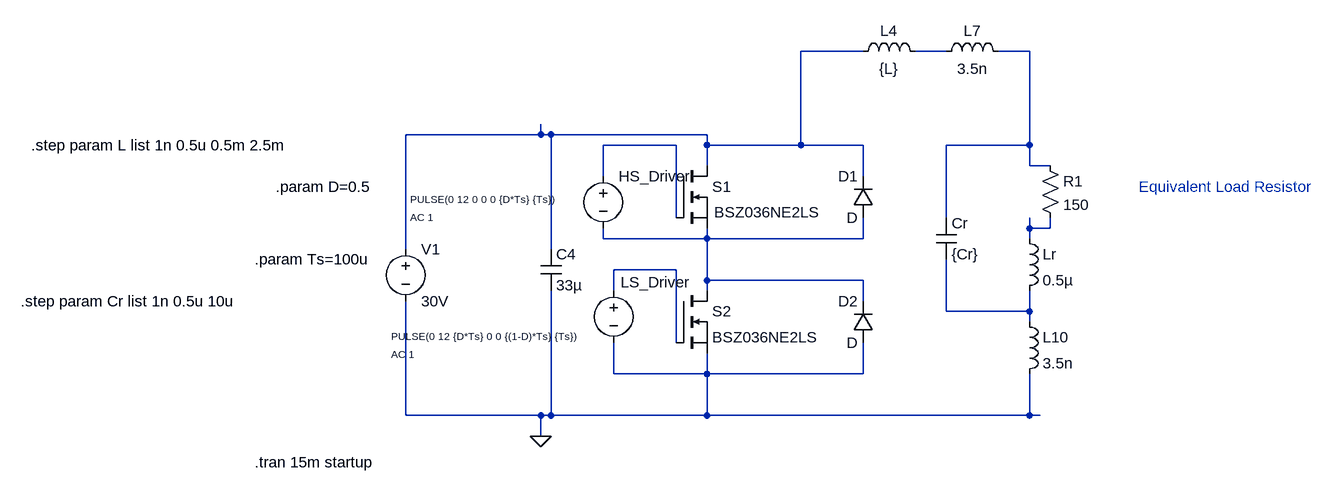
[diagram p0: schematic IdealHalfBridgeCircuitModel.asc]
IdealHalfBridgeCircuitModel.asc, the LTspice schematic file:
Version 4
SHEET 1 1400 680
WIRE 560 -208 464 -208
WIRE 688 -208 640 -208
WIRE 816 -208 768 -208
WIRE 64 -80 64 -96
WIRE 64 -80 -144 -80
WIRE 80 -80 64 -80
WIRE 320 -80 80 -80
WIRE 272 -64 160 -64
WIRE 320 -64 320 -80
WIRE 464 -64 464 -208
WIRE 464 -64 320 -64
WIRE 560 -64 464 -64
WIRE 816 -64 816 -208
WIRE 816 -64 688 -64
WIRE 320 -32 320 -64
WIRE 816 -32 816 -64
WIRE 848 -32 816 -32
WIRE 160 -16 160 -64
WIRE 560 -16 560 -64
WIRE 272 48 272 -64
WIRE 688 48 688 -64
WIRE 816 64 816 48
WIRE 848 64 848 48
WIRE 848 64 816 64
WIRE 160 80 160 64
WIRE 320 80 320 64
WIRE 320 80 160 80
WIRE 560 80 560 48
WIRE 560 80 320 80
WIRE 816 80 816 64
WIRE -144 96 -144 -80
WIRE 80 96 80 -80
WIRE 272 128 176 128
WIRE 320 144 320 80
WIRE 560 144 320 144
WIRE 176 160 176 128
WIRE 320 160 320 144
WIRE 560 176 560 144
WIRE 688 192 688 112
WIRE 816 192 816 160
WIRE 816 192 688 192
WIRE 816 208 816 192
WIRE 272 240 272 128
WIRE 176 288 176 240
WIRE 320 288 320 256
WIRE 320 288 176 288
WIRE 560 288 560 240
WIRE 560 288 320 288
WIRE -144 352 -144 176
WIRE 64 352 -144 352
WIRE 80 352 80 160
WIRE 80 352 64 352
WIRE 320 352 320 288
WIRE 320 352 80 352
WIRE 816 352 816 288
WIRE 816 352 320 352
WIRE 832 352 816 352
WIRE 64 384 64 352
FLAG 64 384 0
SYMBOL nmos 272 -32 R0
WINDOW 3 59 71 Left 2
SYMATTR Value BSZ036NE2LS
SYMATTR InstName S1
SYMBOL nmos 272 160 R0
SYMATTR InstName S2
SYMATTR Value BSZ036NE2LS
SYMBOL diode 576 48 R180
WINDOW 0 24 64 Left 2
WINDOW 3 24 0 Left 2
SYMATTR InstName D1
SYMBOL diode 576 240 R180
WINDOW 0 24 64 Left 2
WINDOW 3 24 0 Left 2
SYMATTR InstName D2
SYMBOL voltage -144 80 R0
WINDOW 123 0 0 Left 0
WINDOW 39 0 0 Left 0
SYMATTR InstName V1
SYMATTR Value 30V
SYMBOL voltage 160 -32 R0
WINDOW 3 -297 51 Left 1
WINDOW 123 -297 79 Left 1
WINDOW 39 0 0 Left 0
SYMATTR Value PULSE(0 12 0 0 0 {D*Ts} {Ts})
SYMATTR Value2 AC 1
SYMATTR InstName HS_Driver
SYMBOL voltage 176 144 R0
WINDOW 0 11 3 Left 2
WINDOW 3 -342 86 Left 1
WINDOW 123 -342 114 Left 1
WINDOW 39 0 0 Left 0
SYMATTR InstName LS_Driver
SYMATTR Value PULSE(0 12 {D*Ts} 0 0 {(1-D)*Ts} {Ts})
SYMATTR Value2 AC 1
SYMBOL ind 800 64 R0
SYMATTR InstName Lr
SYMATTR Value 0.5µ
SYMBOL ind 800 192 R0
SYMATTR InstName L10
SYMATTR Value 3.5n
SYMATTR SpiceLine Rpar=1M Cpar=1n
SYMBOL cap 672 48 R0
SYMATTR InstName Cr
SYMATTR Value {Cr}
SYMATTR SpiceLine Rser=1n Lser=1n
SYMBOL cap 64 96 R0
SYMATTR InstName C4
SYMATTR Value 33µ
SYMATTR SpiceLine Rser=1n Lser=1n
SYMBOL ind 544 -192 R270
WINDOW 0 32 56 VTop 2
WINDOW 3 5 56 VBottom 2
SYMATTR InstName L4
SYMATTR Value {L}
SYMATTR SpiceLine Rser=1u Rpar=1meg Cpar=1n
SYMBOL ind 672 -192 R270
WINDOW 0 32 56 VTop 2
WINDOW 3 5 56 VBottom 2
SYMATTR InstName L7
SYMATTR Value 3.5n
SYMBOL res 832 -48 R0
SYMATTR InstName R1
SYMATTR Value 150
TEXT -344 0 Left 2 !.param D=0.5
TEXT -376 112 Left 2 !.param Ts=100u
TEXT -376 424 Left 2 !.tran 15m startup
TEXT 984 0 Left 2 ;Equivalent Load Resistor
TEXT -720 -64 Left 2 !.step param L list 1n 0.5u 0.5m 2.5m
TEXT -736 176 Left 2 !.step param Cr list 1n 0.5u 10u

The netlist it stands for:
* IdealHalfBridgeCircuitModel.asc
M§S1 N001 N004 N006 N006 BSZ036NE2LS
M§S2 N006 N007 0 0 BSZ036NE2LS
D1 N006 N001 D
D2 0 N006 D
V1 N001 0 30V
V§HS_Driver N004 N006 PULSE(0 12 0 0 0 {D*Ts} {Ts}) AC 1
V§LS_Driver N007 0 PULSE(0 12 {D*Ts} 0 0 {(1-D)*Ts} {Ts}) AC 1
Lr N005 N008 0.5µ
L10 N008 0 3.5n Rpar=1M Cpar=1n
Cr N003 N008 {Cr} Rser=1n Lser=1n
C4 N001 0 33µ Rser=1n Lser=1n
L4 N001 N002 {L} Rser=1u Rpar=1meg Cpar=1n
L7 N002 N003 3.5n
R1 N003 N005 150
.model D D
.lib standard.dio
.model NMOS NMOS
.model PMOS PMOS
.lib standard.mos
.param D=0.5
.param Ts=100u
.tran 15m startup
* Equivalent Load Resistor
.step param L list 1n 0.5u 0.5m 2.5m
.step param Cr list 1n 0.5u 10u
.backanno
.end